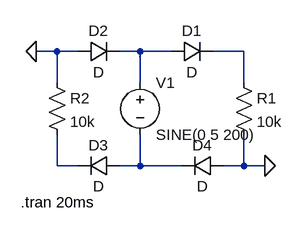
[diagram p0: schematic Sensing Diagram.asc]
Sensing Diagram.asc, the LTspice schematic file:
Version 4
SHEET 1 880 680
WIRE 80 96 48 96
WIRE 112 96 80 96
WIRE 208 96 176 96
WIRE 256 96 208 96
WIRE 368 96 320 96
WIRE 80 144 80 96
WIRE 208 144 208 96
WIRE 368 144 368 96
WIRE 80 272 80 224
WIRE 112 272 80 272
WIRE 208 272 208 224
WIRE 208 272 176 272
WIRE 272 272 208 272
WIRE 368 272 368 224
WIRE 368 272 336 272
WIRE 400 272 368 272
FLAG 48 96 0
FLAG 400 272 0
SYMBOL voltage 208 128 R0
WINDOW 123 0 0 Left 0
WINDOW 39 0 0 Left 0
SYMATTR InstName V1
SYMATTR Value SINE(0 5 200)
SYMBOL res 352 128 R0
SYMATTR InstName R1
SYMATTR Value 10k
SYMBOL res 64 128 R0
SYMATTR InstName R2
SYMATTR Value 10k
SYMBOL diode 256 112 R270
WINDOW 0 32 32 VTop 2
WINDOW 3 0 32 VBottom 2
SYMATTR InstName D1
SYMBOL diode 112 112 R270
WINDOW 0 32 32 VTop 2
WINDOW 3 0 32 VBottom 2
SYMATTR InstName D2
SYMBOL diode 176 256 R90
WINDOW 0 0 32 VBottom 2
WINDOW 3 32 32 VTop 2
SYMATTR InstName D3
SYMBOL diode 336 256 R90
WINDOW 0 0 32 VBottom 2
WINDOW 3 32 32 VTop 2
SYMATTR InstName D4
TEXT 24 328 Left 2 !.tran 20ms

The netlist it stands for:
* Sensing Diagram.asc
V1 N001 N004 SINE(0 5 200)
R1 N002 0 10k
R2 0 N003 10k
D1 N001 N002 D
D2 0 N001 D
D3 N004 N003 D
D4 0 N004 D
.model D D
.lib standard.dio
.tran 20ms
.backanno
.end